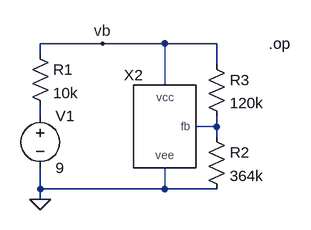
[diagram p0: schematic tb_op.asc]
tb_op.asc, the LTspice schematic file:
Version 4
SHEET 1 880 680
WIRE 64 64 -32 64
WIRE 160 64 64 64
WIRE 240 64 160 64
WIRE -32 80 -32 64
WIRE 240 96 240 64
WIRE 160 128 160 64
WIRE -32 176 -32 160
WIRE 240 192 240 176
WIRE 240 192 208 192
WIRE 240 208 240 192
WIRE -32 288 -32 256
WIRE 160 288 160 256
WIRE 160 288 -32 288
WIRE 240 288 160 288
WIRE -32 304 -32 288
FLAG -32 304 0
FLAG 64 64 vb
SYMBOL voltage -32 160 R0
WINDOW 123 0 0 Left 0
WINDOW 39 0 0 Left 0
SYMATTR InstName V1
SYMATTR Value 9
SYMBOL res -48 64 R0
SYMATTR InstName R1
SYMATTR Value 10k
SYMBOL LM136 160 192 R0
SYMATTR InstName X2
SYMBOL res 224 192 R0
SYMATTR InstName R2
SYMATTR Value 364k
SYMBOL res 224 80 R0
SYMATTR InstName R3
SYMATTR Value 120k
TEXT 320 64 Left 0 !.op

The netlist it stands for:
* tb_op.asc
V1 N001 0 9
R1 vb N001 10k
XX2 N002 vb 0 LM136  ; pins fb vcc vee
R2 N002 0 364k
R3 vb N002 120k
.op
.backanno
.end